# EAGLE design WirelessTempSensor (EAGLE 8.6.3)
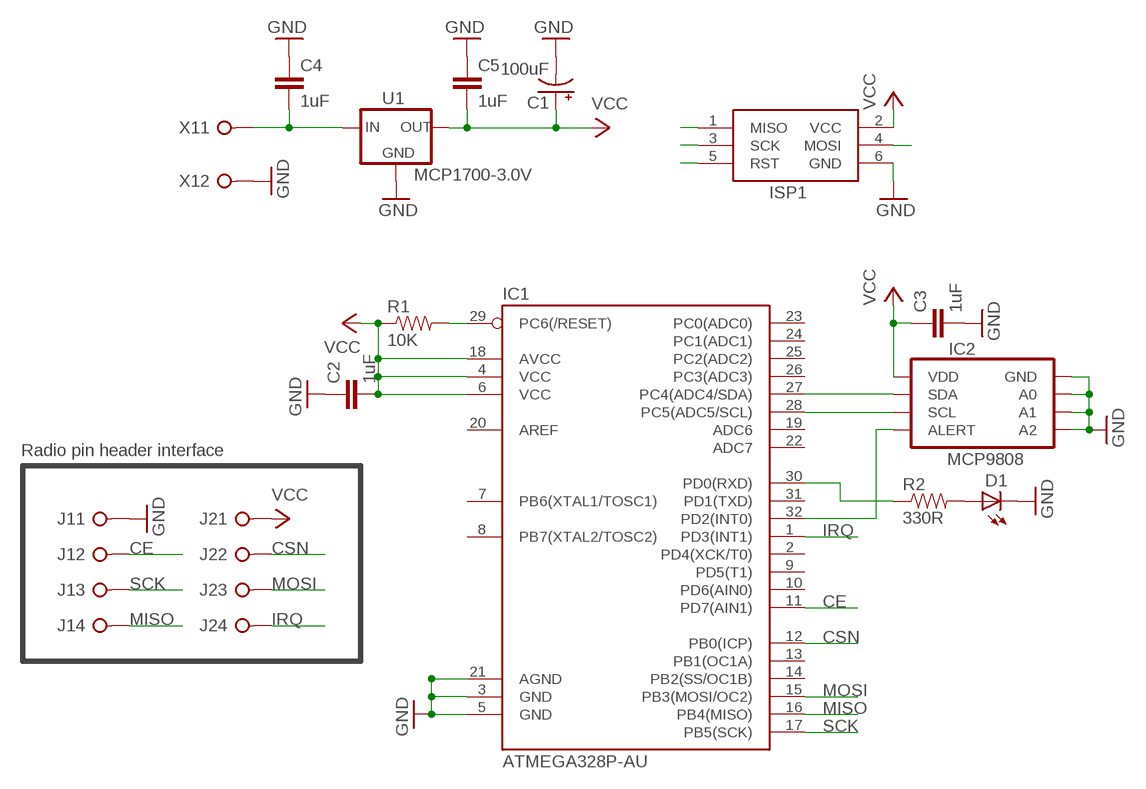
[diagram p0: schematic, sheet 1]

## Parts
C1  100uF  CAP-POL-2.5-6  [CAP-POL-2.5-6]
C2  1uF  CAPACITOR-0805  [CAPACITOR-0805]
C3  1uF  CAPACITOR-0805  [CAPACITOR-0805]
C4  1uF  CAPACITOR-0805  [CAPACITOR-0805]
C5  1uF  CAPACITOR-0805  [CAPACITOR-0805]
D1  LED-0805  [LED-0805]
IC1  ATMEGA328P-AU  [QFP32-08]
IC2  MCP9808  [MSOP8-0.65-3X3MM]
ISP1  ICSP-HEADER-6  [ICSP-HEADER]
J1  PINHD-1X4  [1X04]
J2  PINHD-1X4  [1X04]
R1  10K  RESISTOR-0805  [RESISTOR-0805]
R2  330R  RESISTOR-0805  [RESISTOR-0805]
U1  MCP1700-3.0V  MCP1700-SOT23  [SOT-23-3]
X1  SCREW-TERM-2  [SCREW-TERM-2]

## Nets
ALERT: IC1.32(PD2(INT0)) IC2.3(ALERT)
CE: IC1.11(PD7(AIN1)) J1.2
CSN: IC1.12(PB0(ICP)) J2.2
GND: C1.- C2.1 C3.2 C4.1 C5.1 D1.2(C) IC1.3(GND) IC1.5(GND) IC1.21(AGND) IC2.4(GND) IC2.5(A2) IC2.6(A1) IC2.7(A0) ISP1.6(GND) J1.1 U1.1(GND) X1.2
IRQ: IC1.1(PD3(INT1)) J2.4
MISO: IC1.16(PB4(MISO)) ISP1.1(MISO) J1.4
MOSI: IC1.15(PB3(MOSI/OC2)) ISP1.4(MOSI) J2.3
N$1: IC1.30(PD0(RXD)) R2.1
N$2: D1.1(A) R2.2
RST: IC1.29(PC6(/RESET)) ISP1.5(RST) R1.2
SCK: IC1.17(PB5(SCK)) ISP1.3(SCK) J1.3
SCL: IC1.28(PC5(ADC5/SCL)) IC2.2(SCL)
SDA: IC1.27(PC4(ADC4/SDA)) IC2.1(SDA)
VCC: C1.+ C2.2 C3.1 C5.2 IC1.4(VCC) IC1.6(VCC) IC1.18(AVCC) IC2.8(VDD) ISP1.2(VCC) J2.1 R1.1 U1.2(OUT)
VIN: C4.2 U1.3(IN) X1.1
Unconnected: IC1.2(PD4(XCK/T0)) IC1.7(PB6(XTAL1/TOSC1)) IC1.8(PB7(XTAL2/TOSC2)) IC1.9(PD5(T1)) IC1.10(PD6(AIN0)) IC1.13(PB1(OC1A)) IC1.14(PB2(SS/OC1B)) IC1.19(ADC6) IC1.20(AREF) IC1.22(ADC7) IC1.23(PC0(ADC0)) IC1.24(PC1(ADC1)) IC1.25(PC2(ADC2)) IC1.26(PC3(ADC3)) IC1.31(PD1(TXD))

## Notes on the sheet
- Radio pin header interface

## Library data of the parts
C1 = SaintGimp:CAP-POL-*: Polarized Capacitor
C2-C5 = SaintGimp:CAPACITOR-*: Ceramic Capacitor
D1 = SaintGimp:LED-*
IC1 = SaintGimp:ATMEGA328P-AU
IC2 = SaintGimp:MCP9808
ISP1 = SaintGimp:ICSP-HEADER: ICSP HEADER Standard 6 pin header for ICSP programming
J1 J2 = SaintGimp:PINHD-1X4
R1 R2 = SaintGimp:RESISTOR-*
U1 = SaintGimp:MCP1700
X1 = SaintGimp:SCREW-TERM-2: 2-Pin Screw Terminal

## Board
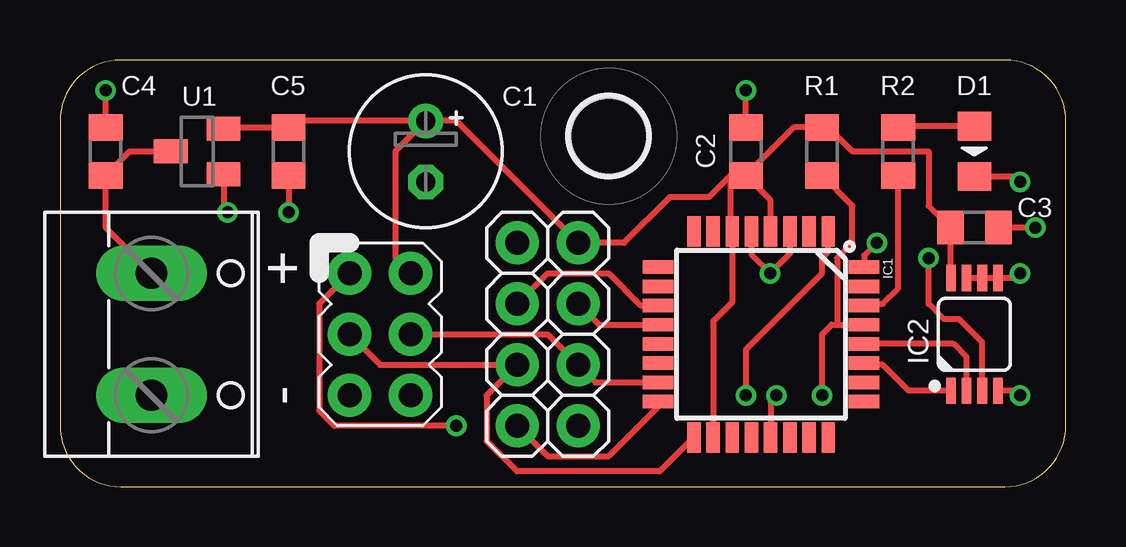
[diagram p1: board, top side]
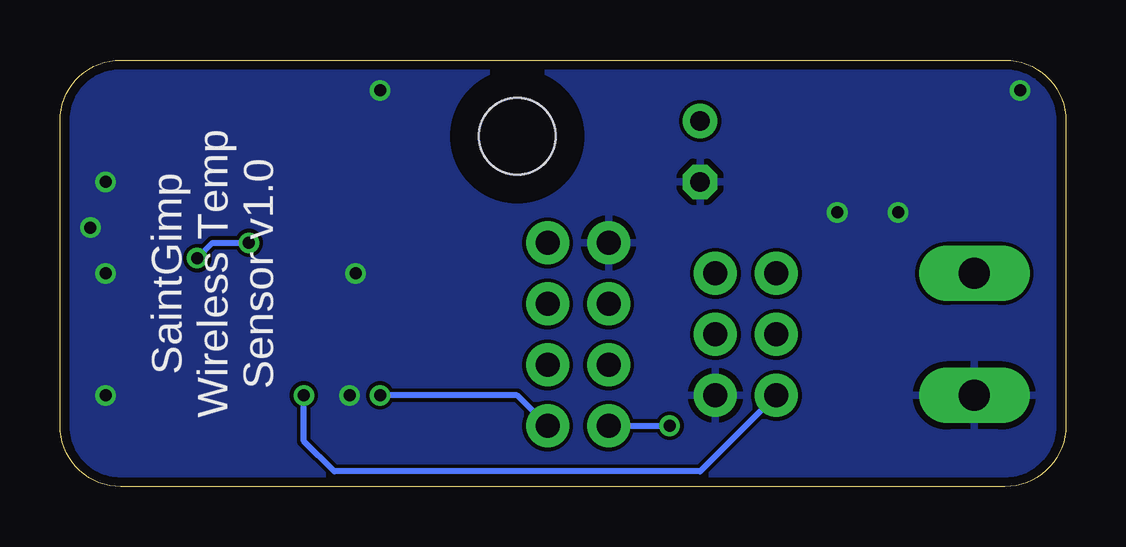
[diagram p2: board, bottom side, seen from below]

Size 41.91 x 17.78 mm. Coordinates in mm from the lower left corner, seen from the top.
Outline: 0,15.24 0,2.54 arc90 2.54,0 39.37,0 arc90 41.91,2.54 41.91,15.24 arc90 39.37,17.78 2.54,17.78 arc90 0,15.24
Copper layers (1*16): Top 0.0356mm / dielectric 1.5011mm / Bottom 0.0356mm
Design rules "Saintgimp-OSHPark": minimum track width 10mil, minimum drill 13mil, track to track 6mil, track to pad 6mil, pad to pad 6mil, via to via 6mil, smd to smd 6mil, copper to edge 15mil, drill to drill 6mil, minimum pad ring 12mil, minimum via ring 7mil, stop-mask expansion 2mil, vias tented up to drill 24mil, thermal gap 10mil

### Footprints (pad centres in the part's own frame; a part is rotated, then mirrored left to right if it is on the bottom)
CAP-POL-2.5-6 = drill 0.8: + -1.27,0 | drill 0.8 octagon: - 1.27,0
CAPACITOR-0805 = smd 1.1 x 1.4: 1 -1,0; 2 1,0
LED-0805 = smd 1.194 x 1.4: 1 -1.047,0; 2 1.047,0
QFP32-08 = smd 1.27 x 0.559: 1 -4.293,2.8; 2 -4.293,2; 3 -4.293,1.2; 4 -4.293,0.4; 5 -4.293,-0.4; 6 -4.293,-1.2; 7 -4.293,-2; 8 -4.293,-2.8; 17 4.293,-2.8; 18 4.293,-2; 19 4.293,-1.2; 20 4.293,-0.4; 21 4.293,0.4; 22 4.293,1.2; 23 4.293,2; 24 4.293,2.8 | smd 0.559 x 1.27: 9 -2.8,-4.293; 10 -2,-4.293; 11 -1.2,-4.293; 12 -0.4,-4.293; 13 0.4,-4.293; 14 1.2,-4.293; 15 2,-4.293; 16 2.8,-4.293; 25 2.8,4.293; 26 2,4.293; 27 1.2,4.293; 28 0.4,4.293; 29 -0.4,4.293; 30 -1.2,4.293; 31 -2,4.293; 32 -2.8,4.293
MSOP8-0.65-3X3MM = smd 1.1 x 0.4: 1 -2.35,0.975; 2 -2.35,0.325; 3 -2.35,-0.325; 4 -2.35,-0.975; 5 2.35,-0.975; 6 2.35,-0.325; 7 2.35,0.325; 8 2.35,0.975
ICSP-HEADER = drill 1: 1 -1.27,2.54; 2 1.27,2.54; 3 -1.27,0; 4 1.27,0; 5 -1.27,-2.54; 6 1.27,-2.54
1X04 = drill 1: 1 -3.81,0; 2 -1.27,0; 3 1.27,0; 4 3.81,0
RESISTOR-0805 = smd 1.1 x 1.4: 1 -1,0; 2 1,0
SOT-23-3 = smd 1 x 1.4: 1 -0.95,-1.1; 2 0.95,-1.1; 3 0,1.1
MOUNTING-HOLE-3.2MM = hole 3.2: 0,0
SCREW-TERM-2 = drill 1.3 long: 1 -2.54,0; 2 2.54,0

### Placement (x,y rotation side)
C1  15.24,13.97 270 top
C2  28.57,13.97 270 top
C3  38.1,10.79 0 top
C4  1.91,13.97 270 top
C5  9.53,13.97 90 top
D1  38.1,13.97 270 top
IC1  29.21,6.35 270 top
IC2  38.1,6.35 90 top
ISP1  13.34,6.35 0 top
J1  19.05,6.35 270 top
J2  21.59,6.35 270 top
R1  31.75,13.97 270 top
R2  34.92,13.97 90 top
U1  5.71,13.97 90 top
U$3  [MOUNTING-HOLE-3.2MM]  22.86,14.61 0 top
X1  3.81,6.35 270 top

### Tracks (layer width: path | path; a pad name or v marks a point on that pad's centre or on a via)
ALERT  (via drill 0.5)
  Top 0.254: IC2.3 38.42,6.03 37.47,6.99 36.83,6.99 36.2,7.62 v36.2,9.53 | v34.04,10.16 33.5,9.63 IC1.32
  Bottom 0.254: v36.2,9.53 35.56,10.16 v34.04,10.16
CE
  Top 0.254: J1.2 20.32,8.89 22.86,8.89 24.2,7.55 IC1.11
CSN
  Top 0.254: J2.2 22.46,6.75 IC1.12
GND  (via drill 0.5)
  Top 0.254: IC1.3 30.41,9.71 v29.59,8.89 28.81,9.67 IC1.5 | IC2.7 IC2.6 IC2.5 39.81,8.7 v40.01,8.89 | C2.1 v28.57,16.51 | v40.01,12.7 39.78,12.92 D1.2 | 39.08,10.77 C3.2 v40.64,10.79 | U1.1 6.82,11.6 v6.99,11.43 | C4.1 v1.91,16.51 | C5.1 v9.53,11.43 | v29.84,3.81 29.61,3.58 IC1.21 | v40.01,3.81 39.81,4 IC2.4
  pour Bottom: 0,17.78 0,0 41.91,0 41.91,17.78
IRQ  (via drill 0.5)
  Top 0.254: IC1.1 32.01,9.79 31.75,9.53 31.75,8.89 28.57,5.71 v28.57,3.81
  Bottom 0.254: J2.4 22.86,3.81 v28.57,3.81
MISO  (via drill 0.5)
  Top 0.254: ISP1.1 10.79,7.62 10.79,3.17 11.43,2.54 v16.51,2.54 | J1.4 20.32,1.27 22.86,1.27 24.92,3.33 IC1.16
  Bottom 0.254: J1.4 v16.51,2.54
MOSI
  Top 0.254: ISP1.4 20.32,6.35 J2.3 22.32,4.35 IC1.15
N$1
  Top 0.254: IC1.30 33.57,7.62 34.29,7.62 34.92,8.26 R2.1
N$2
  Top 0.254: D1.1 34.97,15.02 R2.2
RST  (via drill 0.5)
  Top 0.254: v31.75,3.81 31.75,6.35 32.15,6.75 32.38,6.75 | 32.38,6.75 IC1.29 | 32.38,6.75 32.38,9.53 33.02,10.16 33.02,11.7 R1.2
  Bottom 0.254: ISP1.5 15.24,0.64 30.48,0.64 31.75,1.91 v31.75,3.81
SCK
  Top 0.254: ISP1.3 13.34,5.08 J1.3 17.78,3.81 17.78,1.91 19.05,0.64 24.99,0.64 IC1.17
SCL
  Top 0.254: IC2.2 37.77,5.41 37.23,5.95 IC1.28
SDA
  Top 0.254: IC2.1 35.37,4 34.29,5.08 33.57,5.08 IC1.27
VCC
  Top 0.254: IC1.18 27.21,6.89 28.01,7.69 IC1.6 27.94,10.71 27.94,12.97 | C1.+ 13.97,13.97 13.97,9.53 ISP1.2 | C1.+ 16.51,15.24 J2.1 23.5,10.16 25.4,12.06 27.04,12.06 27.94,12.97 | 27.94,12.97 C2.2 | IC1.4 29.61,11.94 C2.2 | C2.2 30.57,14.97 R1.1 32.02,14.97 33.02,13.97 36.2,13.97 36.2,11.7 C3.1 37.1,8.72 IC2.8 | U1.2 6.87,14.97 C5.2 | C5.2 9.89,14.61 | C1.+ 9.79,15.24 C5.2
VIN
  Top 0.254: X1.1 1.91,10.79 C4.2 2.9,13.97 U1.3

### Text on the board
_tsilk: + | -
_bsilk: SaintGimp / Wireless Temp / Sensor v1.0